# Altium schematic sheet LED_DRIVER.SchDoc
size A4; SheetNumber: 1; SheetTotal: 2
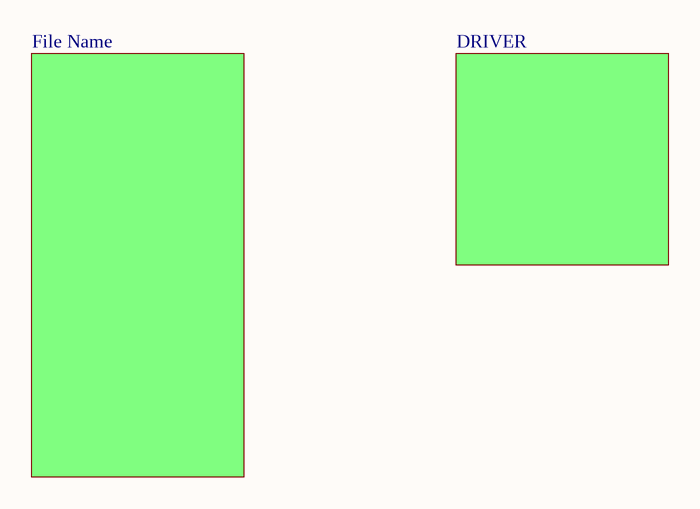
[diagram p0: LED_DRIVER.SchDoc]

## Sub-sheets
DRIVER = DRIVER: no entries
MCU = File Name: no entries